# Altium project main.PrjPCB (part 1 of 2)
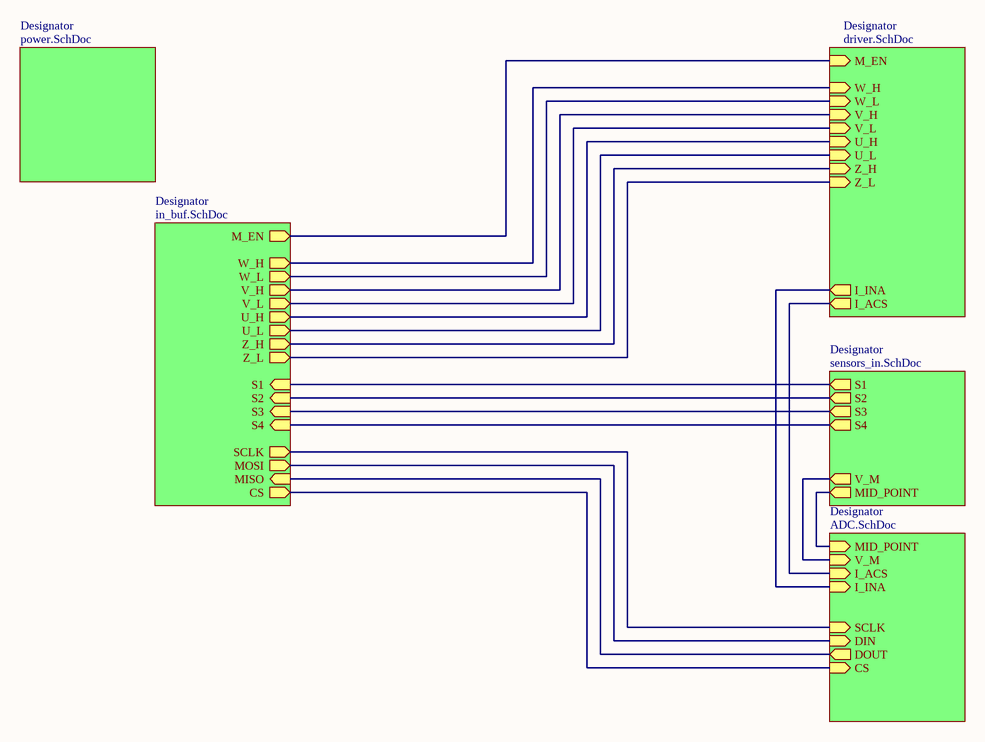
[diagram p0: top.SchDoc]
6 sheets, 154 parts. Net scope: hierarchical (ports join the sheet entries above them; power ports are global).
Board file: PCB1.PcbDoc
Sheets:
  top.SchDoc
    Designator = power.SchDoc
    Designator = driver.SchDoc
    Designator = ADC.SchDoc
    Designator = in_buf.SchDoc
    Designator = sensors_in.SchDoc

## Sheet top.SchDoc
size A4

### Sub-sheets
Designator = power.SchDoc: no entries
Designator = driver.SchDoc: Z_L (in), Z_H (in), U_L (in), V_L (in), U_H (in), I_INA (out), M_EN (in), W_H (in), W_L (in), V_H (in), I_ACS (out)
Designator = ADC.SchDoc: I_ACS (in), SCLK (in), MID_POINT (in), CS (in), I_INA (in), V_M (in), DIN (in), DOUT (out)
Designator = in_buf.SchDoc: U_L (out), MOSI (out), Z_H (out), S1 (in), M_EN (out), V_H (out), S4 (in), SCLK (out), Z_L (out), CS (out), MISO (in), W_L (out), S2 (in), S3 (in), V_L (out), U_H (out), W_H (out)
Designator = sensors_in.SchDoc: S1 (out), S4 (out), V_M (out), MID_POINT (out), S2 (out), S3 (out)

### Nets
CS: sheet Designator/CS, sheet Designator/CS
DIN: sheet Designator/DIN, sheet Designator/MOSI
DOUT: sheet Designator/DOUT, sheet Designator/MISO
I_ACS: sheet Designator/I_ACS, sheet Designator/I_ACS
I_INA: sheet Designator/I_INA, sheet Designator/I_INA
M_EN: sheet Designator/M_EN, sheet Designator/W_L, sheet Designator/M_EN, sheet Designator/W_L
MID_POINT: sheet Designator/MID_POINT, sheet Designator/MID_POINT
S1: sheet Designator/S1, sheet Designator/S1
S2: sheet Designator/S2, sheet Designator/S2
S3: sheet Designator/S3, sheet Designator/S3
S4: sheet Designator/S4, sheet Designator/S4
SCLK: sheet Designator/SCLK, sheet Designator/SCLK
U_H: sheet Designator/U_H, sheet Designator/U_H
U_L: sheet Designator/U_L, sheet Designator/U_L
V_H: sheet Designator/V_H, sheet Designator/V_H
V_L: sheet Designator/V_L, sheet Designator/V_L
V_M: sheet Designator/V_M, sheet Designator/V_M
W_H: sheet Designator/W_H, sheet Designator/W_H
Z_H: sheet Designator/Z_H, sheet Designator/Z_H
Z_L: sheet Designator/Z_L, sheet Designator/Z_L

## Sheet power.SchDoc
size A4
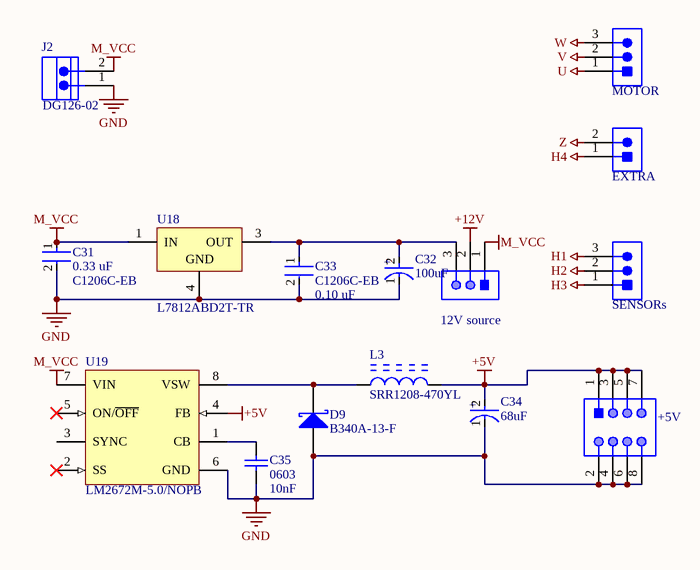
[diagram p1: power.SchDoc]

### Parts
12V_source  61300311121  [61300311121]  (value not drawn)
+5V  61300821121  [61300821121]  (value not drawn)
C31  Capacitance: 0.33 uF  Package: C1206C-EB  [FP-C1206C-EB-IPC_A]  (hidden comment: C1206C334M3VACTU)
C32  Capacitance: 100uF  [FP-PCR1J101MCL1GS-MFG]  (hidden comment: PCR1J101MCL1GS)
C33  Package: C1206C-EB  Capacitance: 0.10 uF  [FP-C1206C-EB-IPC_A]  (hidden comment: C1206C104KARACTU)
C34  Capacitance: 68uF  [FP-PCR1J101MCL1GS-MFG]  (hidden comment: PCR1J101MCL1GS)
C35  value 10nF  Case-EIA: 0603  [CAPC0603(1608)100_M]  (hidden comment: CAP 1nF 16V 0603(1608))
D9  B340A-13-F  [DIOD-SMA-2_V]
EXTRA  SCREW-5.0/5.08 2WAYS  [SCREW-5.0-2WAYS_V]  (value not drawn)
J2  DG126-02  [CXKF-KF129C-2_V]
L3  SRR1208-470YL  [BOUR-SRR1280-2_V]
MOTOR  SCREW-5.0/5.08 3WAYS  [SCREW-5.0-3WAYS_V]  (value not drawn)
SENSORs  SCREW-5.0/5.08 3WAYS  [SCREW-5.0-3WAYS_V]  (value not drawn)
U18  L7812ABD2T-TR  [TO-263_L]
U19  LM2672M-5.0/NOPB  [M08A_N]

### Nets
+5V: +5V.1 +5V.3 +5V.5 +5V.7 C34.2(A) L3.2 U19.4(FB)
+12V: 12V_source.2
GND: +5V.2 +5V.4 +5V.6 +5V.8 C31.2 C32.1(C) C33.2 C34.1(C) C35.1 D9.1(A) J2.1 U18.4(GND) U19.6(GND)
H1: SENSORs.3
H2: SENSORs.2
H3: SENSORs.1
H4: EXTRA.1
M_VCC: 12V_source.1 C31.1 J2.2 U18.1(IN) U19.7(VIN)
U: MOTOR.1
V: MOTOR.2
W: MOTOR.3
Z: EXTRA.2
Net12V_source_3: 12V_source.3 C32.2(A) C33.1 U18.3(OUT)
NetC35_2: C35.2 U19.1(CB)
NetD9_2: D9.2(K) L3.1 U19.8(VSW)

Not connected (* = marked no-connect by the designer): U19 2(SS)* 3(SYNC) 5(ON/~{OFF})*

### Notes on the sheet
- (in symbol CMP-12462-000005-1) +

### Library data of the parts
12V_source = CMP-1502-01062-1: THT Vertical Pin Header WR-PHD, Pitch 2.54 mm, Single Row, 3 pins; Manufacturer: Wurth Elektronik; Withstanding Voltage: 500VAC; Working Voltage: 250VAC; Rated Current: 3A; Pitch: 2.54mm; Pin Number: 3; Gender: Male; Contact Resistance: 20mOhm; Package Reference: 61300311121; Manufacturer URL: http://www.we-online.de; Datasheet URL: https://katalog.we-online.de/em/datasheet/6130xx11121.pdf; Operating Temperature: -40to105degC; Part Number: 61300311121; Orientation: Vertical; Packaging: Bag; Row Number: Single; Mounting Technology: THT; Publisher: WurthElektronik
+5V = CMP-1502-01078-1: THT Vertical Pin Header WR-PHD, Pitch 2.54 mm, Dual Row, 8 pins; Manufacturer: Wurth Elektronik; Contact Resistance: 20mOhm; Rated Current: 3A; Working Voltage: 250VAC; Pin Number: 8; Withstanding Voltage: 500VAC; Pitch: 2.54mm; Gender: Male; Datasheet URL: https://katalog.we-online.de/em/datasheet/6130xx21121.pdf; Package Reference: 61300821121; Orientation: Vertical; Part Number: 61300821121; Publisher: WurthElektronik; Mounting Technology: THT; Manufacturer URL: http://www.we-online.de; Packaging: Bag; Row Number: Dual; Operating Temperature: -40to105degC
C31 = CMP-03020-000898-1: CAP CER 0.33UF 25V Y5V 1206; Manufacturer: KEMET; Material: Ceramic; Value: 0.33 μF; Automotive Grade: Grade 0; Tolerance: 0.2; Temperature Coefficient: 15%; Ipc Land Pattern Name: CAPC320160X78; Height: 0.88mm; Automotive: Yes; Category: Cap; Manufacturer Part Number: C1206C334M3VACTU; Temperature Range High: +150°C; ComponentLink2URL: https://content.kemet.com/datasheets/KEM_C1007_X8R_ULTRA_150C_SMD.pdf; Device Class L3: Ceramic Capacitors; Device Class L2: Capacitors; Temperature: -55°C to +150°C; ComponentLink2Description: Datasheet; Mouser Description: Multilayer Ceramic Capacitors MLCC - SMD/SMT 25volts 0.33uF Y5V 20%; Octopart: https://octopart.com/c1206c334m3vactu-kemet-9139506; Temperature Characteristic: Y5V; Digikey Description: CAP CER 0.33UF 25V Y5V 1206; Voltage Rating: 25 V; Lead Free: Yes; RoHS: TRUE; Device Class L1: Passive Components; Temperature Range Low: -55°C
C32 C34 = CMP-12462-000005-1: CAP ALUM POLY 100UF 20% 63V SMD; Manufacturer: Nichicon; Ripple Current: 3000mA; Automotive Grade: Grade 1; Esr: 24mΩ; Dissipation Factor: 8%; Material: Aluminum; Life: 4000Hours; Leakage Current: 189uA; Voltage Rating: 63V; Device Class L1: Passive Components; Package: 0; Automotive: Yes; Manufacturer Part Number: PCR1J101MCL1GS; Device Class L3: Aluminum Electrolytic Capacitors; ComponentLink2URL: https://www.nichicon.co.jp/english/products/pdfs/e-pcr.pdf; Category: Cap; ComponentLink2Description: Datasheet; Lead Free: Yes; Tolerance: 20%; Digikey Description: CAP ALUM POLY 100UF 20% 63V SMD; Temperature: -55°C to +125°C; Temperature Range High: +125°C; Value: 100uF; Temperature Range Low: -55°C; Height: 12.7mm; Octopart: https://octopart.com/pcr1j101mcl1gs-nichicon-34508535; Device Class L2: Capacitors; Footprint Url: https://www.nichicon.co.jp/english/products/pdfs/e-p_ref.pdf; RoHS: TRUE
C33 = CMP-03020-000666-1: CAP CER 0.1UF 250V X7R 1206; Manufacturer: KEMET; Material: Ceramic; Temperature Coefficient: 15%; Value: 0.10 μF; Tolerance: 0.1; Automotive Grade: Grade 0; Mouser Description: Multilayer Ceramic Capacitors MLCC - SMD/SMT 250volts 0.1uF X7R 10%; Height: 0.88mm; Device Class L3: Ceramic Capacitors; Temperature Range Low: -55°C; Automotive: Yes; ComponentLink2Description: Datasheet; Category: Cap; RoHS: TRUE; Manufacturer Part Number: C1206C104KARACTU; Temperature Range High: +150°C; Device Class L2: Capacitors; Voltage Rating: 250 V; Lead Free: Yes; Temperature Characteristic: X7R; Digikey Description: CAP CER 0.1UF 250V X7R 1206; ComponentLink2URL: https://content.kemet.com/datasheets/KEM_C1007_X8R_ULTRA_150C_SMD.pdf; Device Class L1: Passive Components; Ipc Land Pattern Name: CAPC320160X78; Temperature: -55°C to +150°C; Octopart: https://octopart.com/c1206c104karactu-kemet-193627
C35 = CMP-1035-01877-1: CAP 1nF 16V ±2% 0603 (1608 Metric) Thickness 1mm SMD; Case-Metric: 1608; Tolerance: Â±2%; Max Thickness: 1 mm; Rated Voltage: 16 V; Technology: SMT
D9 = CMP-1667-00003-1: Surface Mount Schottky Barrier Rectifier, 40 V, 3 A, -55 to 150 degC, 2-Pin SMA, RoHS, Tape and Reel; Forward Current: 3 A; Forward Voltage: 500 mV; Max Surge Current: 80 A; Peak Reverse Current: 500 uA; Elements: 1; Mounting Technology: Surface Mount; ComponentLink1URL: http://www.diodes.com/; PackageDescription: 2-Pin Surface Mounted Assembly, Body 4.3 x 2.605 mm, Height 2.4 mm; Min Operating Temperature: -55 degC; Mount: Surface Mount; Pins: 2; ComponentLink2URL: http://www.diodes.com/_files/datasheets/ds30891.pdf; PackageReference: SMA-2; Max Operating Temperature: 125 degC; Radiation Hardening: No; Length: 4.6 mm; RoHSCompliant: true; ComponentLink1Description: Manufacturer URL; Height: 2.1 mm; ComponentLink2Description: Datasheet; Packaging: Tape and Reel; Package Quantity: 5000; Case\Package: SMA; DatasheetVersion: Rev. 17 - 2, 09/2015; REACH SVHC: No SVHC; Width: 2.92 mm
EXTRA = CMP-0617-00009-1: Socket, Screw Terminal Block, 2 Way, 5.0 mm Pitch, 90 Degree Angle, Through-Hole; Manufacturer: No Vendor; Insulation Resistance: 5000 MOhm / 1000 V; Contact Resistance: 20 mOhm; Rated Current: 25 A; Poles: 2; Rated Voltage: 300 V; PartNumber: SCREW-5.0/5.08 2WAYS; ComponentLink1Description: Datasheet; ComponentLink1URL: 5mm screw terminal in SVN; Mounting Technology: Through Hole; PackageDescription: Socket, Screw Terminal Block, 2 Way, Pitch 5 mm, 90 Degree Angle, Through-Hole; Temperature Range: -40 to 105 degC
J2 = CMP-0813-00004-1: Euro Terminal Block, 20 A, 300 V, -40 to 105 degC, Pitch 5 mm, 1 x 2 Position, Height 19.2 mm, Tail Length 3.5 mm; PartNumber: KF129C-02P-14; Manufacturer: Cixi KaiFeng; Insulation Resistance: 5000 MOhm / 1000 V; Pitch: Single Pitch; No. of Pole: 2; Rated Voltage: 300 V; Contact: Brass; Rated Current: 20 A; Contact Resistance: 20 mOhm; Withstanding Voltage: AC 1500 V / 1 Min; ComponentLink2Description: Datasheet; PackageReference: KF129C-2; ComponentLink1URL: http://www.nb-kaifeng.com/; ComponentLink2URL: http://www.nb-kaifeng.com/upload/editor/ext_pdf/201208170644598657.pdf; Color: Green; PackageDescription: Terminal Block, Pitch 5 mm, 1 x 2 Position, Height 19.2 mm, Tail Length 3.5 mm; Temp. Range: -40 to 105 degC; Mounting Technology: Through Hole; ComponentLink1Description: Manufacturer URL
L3 = CMP-2000-07147-1: Semi-Shielded Power Inductor, 100 uH, +/- 20%, 2.1 A, -40 to 125 degC, 2-Pin SMD, RoHS, Tape and Reel; Manufacturer: Bourns; Frequency - Self Resonant: 4.5MHz; Frequency - Test: 100kHz; Material - Core: Ferrite; EDA / CAD Models: DownloadfromAcceleratedDesigns; Other Names: SRR1280-101MTR / SRR1280101M; Q @ Freq: 18@796kHz; Product Training Modules: MagneticProductOverview; Current Rating: 2.1A; Inductance: 100µH; PCN Design/Specification: SRR12(6,8,1)0,PM12(5,7)SHModels17/Aug/2011; Online Catalog: SRRSeries; Type: Wirewound; PCN Assembly/Origin: MagneticproductsOct/2013; 3D Model: SRR1208.stp; Current - Saturation: 2A; DC Resistance (DCR): 150mOhmMax; Mounting Type: SurfaceMount; RoHS Information: SRR1280SeriesMaterialDeclaration; Manufacturer URL: http://www.bourns.com/; Packaging: Tape&Reel(TR); Package URL: http://www.bourns.com/docs/Product-Datasheets/SRR1280.pdf; Package / Case: Nonstandard; Datasheet URL: http://www.bourns.com/pdfs/SRR1280.pdf; Mounting Technology: SurfaceMount; Operating Temperature: -40°C~125°C; Shielding: Shielded; Category: Inductors,Coils,Chokes; Tolerance: ±20%; Package Reference: SRR1280-2; Datasheet Version: 03/2015; Family: FixedInductors; Package Description: 2-Pin Surface Mount Device, Body 12.5 x 12.5 mm; Series: SRR1280; Standard Package: 400
MOTOR SENSORs = CMP-0617-00010-1: Socket, Screw Terminal Block, 3 Way, 5.0 mm Pitch, 90 Degree Angle, Through-Hole; Manufacturer: No Vendor; Insulation Resistance: 5000 MOhm / 1000 V; Rated Voltage: 300 V; Poles: 3; Contact Resistance: 20 mOhm; Rated Current: 25 A; PartNumber: SCREW-5.0/5.08 3WAYS; PackageDescription: Socket, Screw Terminal Block, 3 Way, Pitch 5 mm, 90 Degree Angle, Through-Hole; Temperature Range: -40 to 105 degC; ComponentLink1Description: Datasheet; ComponentLink1URL: 5mm screw terminal in SVN; Mounting Technology: Through Hole
U18 = CMP-0244-00181-1: Positive Voltage Regulator, 3-Pin D2PAK, Tape and Reel; ComponentLink1Description: Manufacturer URL; ComponentLink2URL: http://www.st.com/internet/com/TECHNICAL_RESOURCES/TECHNICAL_LITERATURE/DATASHEET/CD00000444.pdf; PackageVersion: 2011; PackageDescription: 3-Pin Transistor Outline Package 2.54 mm Pitch, 15.4 mm Lead Span (D2PAK); DatasheetVersion: 16/11/2011; PackageReference: TO-263; ComponentLink1URL: http://www.st.com; ComponentLink2Description: Datasheet
U19 = CMP-0069-00668-1: SIMPLE SWITCHER® Power Converter High Efficiency 1A Step-Down Voltage Regulator with Features, 8-pin Narrow SOIC, Pb-Free; Manufacturer: National Semiconductor; PowerWise: N; PackageTopMarking: NSZXTT*2672*M5.0; PackageReference: M08A; CompType: Switcher; Code_IPC: SOIC127P600-8; PackageDescription: SOIC Narrow, 4.9 x 3.9 x 1.45mm, 8 Lead, 1.27mm Pitch; Code_JEDEC: MS-012-AA; RoHS: Y; PackageVersion: revM, May-2009; DatasheetVersion: Apr-2007; PinCount: 8

## Sheet driver.SchDoc
size A3
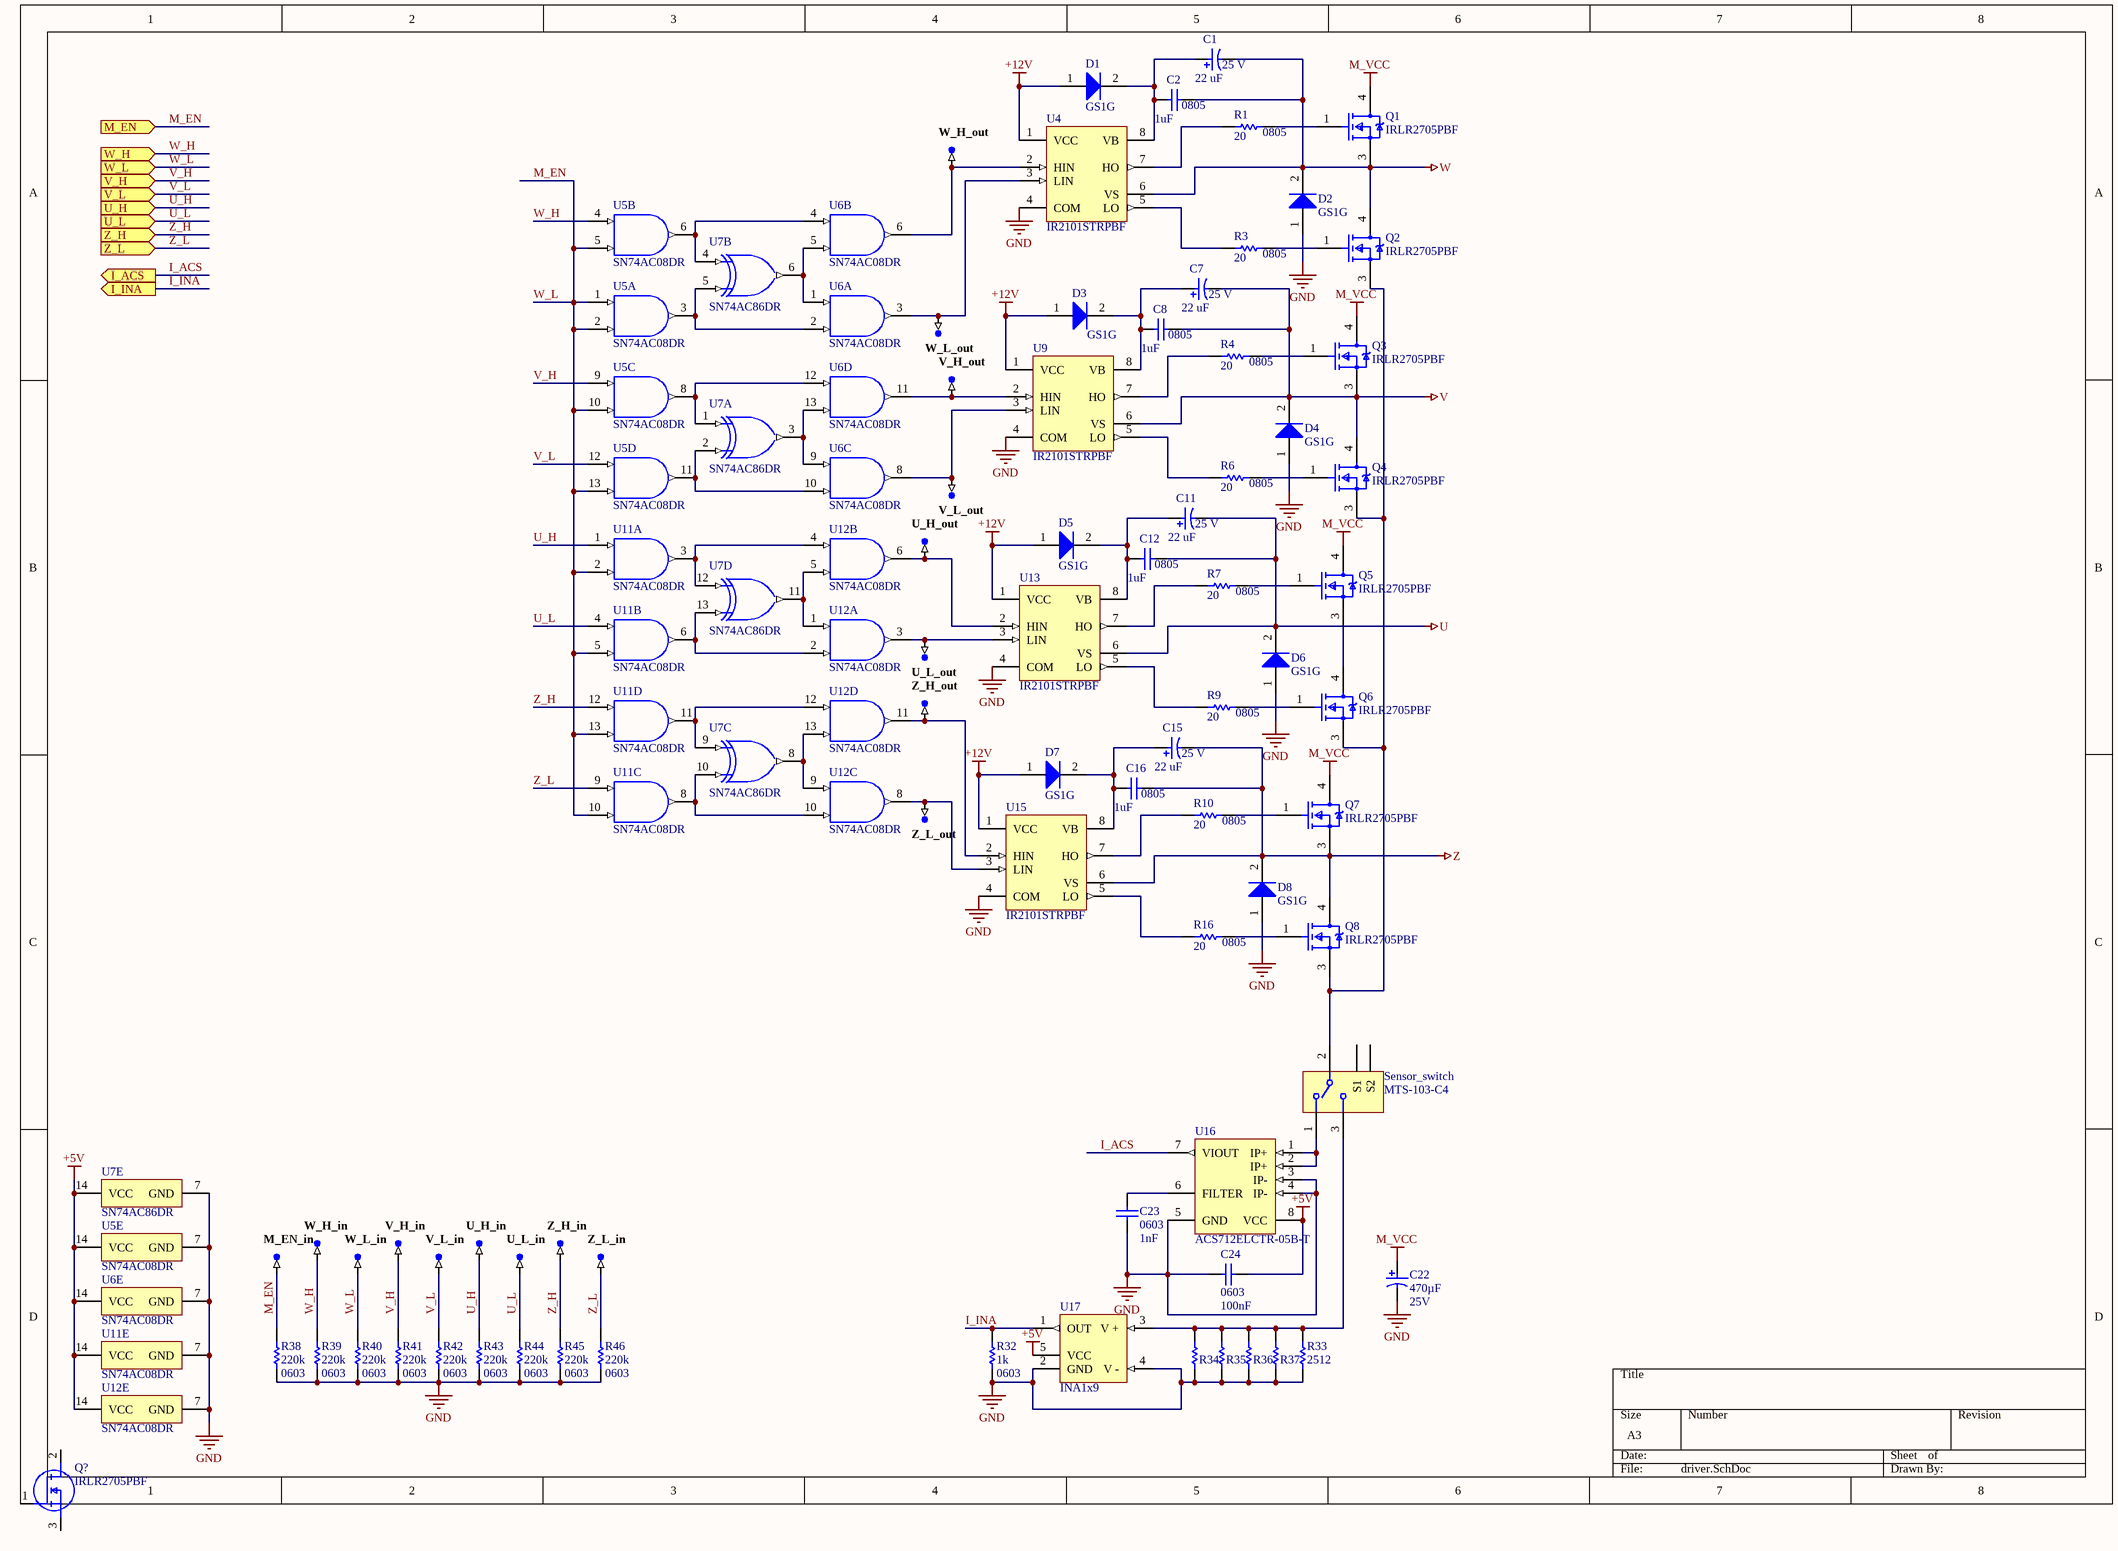
[diagram p2: driver.SchDoc]

### Parts
C1  Rated Voltage: 25 V  Capacitance: 22 uF  [PNSC-FT-V-43x43-2_V]  (hidden comment: EEE-FT1E220AR)
C2  value 1uF  Case-EIA: 0805  [CAPC0805(2012)145_M]  (hidden comment: CAP 1uF 50V 0805(2012))
C7  Rated Voltage: 25 V  Capacitance: 22 uF  [PNSC-FT-V-43x43-2_V]  (hidden comment: EEE-FT1E220AR)
C8  value 1uF  Case-EIA: 0805  [CAPC0805(2012)145_M]  (hidden comment: CAP 1uF 50V 0805(2012))
C11  Rated Voltage: 25 V  Capacitance: 22 uF  [PNSC-FT-V-43x43-2_V]  (hidden comment: EEE-FT1E220AR)
C12  value 1uF  Case-EIA: 0805  [CAPC0805(2012)145_M]  (hidden comment: CAP 1uF 50V 0805(2012))
C15  Rated Voltage: 25 V  Capacitance: 22 uF  [PNSC-FT-V-43x43-2_V]  (hidden comment: EEE-FT1E220AR)
C16  value 1uF  Case-EIA: 0805  [CAPC0805(2012)145_M]  (hidden comment: CAP 1uF 50V 0805(2012))
C22  Capacitance: 470µF  Rated Voltage: 25V  [PNSC-FP-V-G_V]  (hidden comment: EEEFP1E471AP)
C23  value 1nF  Case-EIA: 0603  [CAPC0603(1608)100_M]  (hidden comment: CAP 1nF 16V 0603(1608))
C24  Case Code (Imperial): 0603  Capacitance: 100nF  [CAPC1608X90X35ML10T15]  (hidden comment: GRM188R71H104KA93D)
D1  GS1G  [VISH-DO-214AC_V]
D2  GS1G  [VISH-DO-214AC_V]
D3  GS1G  [VISH-DO-214AC_V]
D4  GS1G  [VISH-DO-214AC_V]
D5  GS1G  [VISH-DO-214AC_V]
D6  GS1G  [VISH-DO-214AC_V]
D7  GS1G  [VISH-DO-214AC_V]
D8  GS1G  [VISH-DO-214AC_V]
M_EN_in  TP-SM-C-100  [TP-SM-C-100]  (value not drawn)  (no BOM)
Q1  IRLR2705PBF  [FP-PG-TO252-3-MFG]
Q2  IRLR2705PBF  [FP-PG-TO252-3-MFG]
Q3  IRLR2705PBF  [FP-PG-TO252-3-MFG]
Q4  IRLR2705PBF  [FP-PG-TO252-3-MFG]
Q5  IRLR2705PBF  [FP-PG-TO252-3-MFG]
Q6  IRLR2705PBF  [FP-PG-TO252-3-MFG]
Q7  IRLR2705PBF  [FP-PG-TO252-3-MFG]
Q8  IRLR2705PBF  [FP-PG-TO252-3-MFG]
Q?  IRLR2705PBF  [IRLR2705PBF]
R1  value 20  Case-EIA: 0805  [RESC0805(2012)_M]  (hidden comment: 20R 1% 0805(2012))
R3  value 20  Case-EIA: 0805  [RESC0805(2012)_M]  (hidden comment: 20R 1% 0805(2012))
R4  value 20  Case-EIA: 0805  [RESC0805(2012)_M]  (hidden comment: 20R 1% 0805(2012))
R6  value 20  Case-EIA: 0805  [RESC0805(2012)_M]  (hidden comment: 20R 1% 0805(2012))
R7  value 20  Case-EIA: 0805  [RESC0805(2012)_M]  (hidden comment: 20R 1% 0805(2012))
R9  value 20  Case-EIA: 0805  [RESC0805(2012)_M]  (hidden comment: 20R 1% 0805(2012))
R10  value 20  Case-EIA: 0805  [RESC0805(2012)_M]  (hidden comment: 20R 1% 0805(2012))
R16  value 20  Case-EIA: 0805  [RESC0805(2012)_M]  (hidden comment: 20R 1% 0805(2012))
R32  Resistance (Ohms): 1k  Package Reference: 0603  [RESC1608X55X30ML15T20]  (hidden comment: RMCF0603FT10K0)
R33  Case-EIA: 2512  [RESC2512(6432)_N]  (hidden comment: 1R 5% 2512(6432))
R34  1R 5% 2512(6432)  [RESC2512(6432)_N]  (value not drawn)
R35  1R 5% 2512(6432)  [RESC2512(6432)_N]  (value not drawn)
R36  1R 5% 2512(6432)  [RESC2512(6432)_N]  (value not drawn)
R37  1R 5% 2512(6432)  [RESC2512(6432)_N]  (value not drawn)
R38  Resistance (Ohms): 220k  Package Reference: 0603  [RESC1608X55X30ML15T20]  (hidden comment: RMCF0603FT10K0)
R39  Resistance (Ohms): 220k  Package Reference: 0603  [RESC1608X55X30ML15T20]  (hidden comment: RMCF0603FT10K0)
R40  Resistance (Ohms): 220k  Package Reference: 0603  [RESC1608X55X30ML15T20]  (hidden comment: RMCF0603FT10K0)
R41  Resistance (Ohms): 220k  Package Reference: 0603  [RESC1608X55X30ML15T20]  (hidden comment: RMCF0603FT10K0)
R42  Resistance (Ohms): 220k  Package Reference: 0603  [RESC1608X55X30ML15T20]  (hidden comment: RMCF0603FT10K0)
R43  Resistance (Ohms): 220k  Package Reference: 0603  [RESC1608X55X30ML15T20]  (hidden comment: RMCF0603FT10K0)
R44  Resistance (Ohms): 220k  Package Reference: 0603  [RESC1608X55X30ML15T20]  (hidden comment: RMCF0603FT10K0)
R45  Resistance (Ohms): 220k  Package Reference: 0603  [RESC1608X55X30ML15T20]  (hidden comment: RMCF0603FT10K0)
R46  Resistance (Ohms): 220k  Package Reference: 0603  [RESC1608X55X30ML15T20]  (hidden comment: RMCF0603FT10K0)
Sensor_switch  MTS-103-C4  [SALE-T8019L-5_V]
U4  IR2101STRPBF  [INTR-SOIC-8_V]
U5  SN74AC08DR  [D0014A_M]  (parts A,B,C,D,E of 5)
U6  SN74AC08DR  [D0014A_M]  (parts A,B,C,D,E of 5)
U7  SN74AC86DR  [D0014A_M]  (parts A,B,C,D,E of 5)
U9  IR2101STRPBF  [INTR-SOIC-8_V]
U11  SN74AC08DR  [D0014A_M]  (parts A,B,C,D,E of 5)
U12  SN74AC08DR  [D0014A_M]  (parts A,B,C,D,E of 5)
U13  IR2101STRPBF  [INTR-SOIC-8_V]
U15  IR2101STRPBF  [INTR-SOIC-8_V]
U16  ACS712ELCTR-05B-T  [ALEG-LC-8_V]
U17  INA1x9  [DIOD-SOT23-5_V]
U_H_in  TP-SM-C-100  [TP-SM-C-100]  (value not drawn)  (no BOM)
U_H_out  TP-SM-C-100  [TP-SM-C-100]  (value not drawn)  (no BOM)
U_L_in  TP-SM-C-100  [TP-SM-C-100]  (value not drawn)  (no BOM)
U_L_out  TP-SM-C-100  [TP-SM-C-100]  (value not drawn)  (no BOM)
V_H_in  TP-SM-C-100  [TP-SM-C-100]  (value not drawn)  (no BOM)
V_H_out  TP-SM-C-100  [TP-SM-C-100]  (value not drawn)  (no BOM)
V_L_in  TP-SM-C-100  [TP-SM-C-100]  (value not drawn)  (no BOM)
V_L_out  TP-SM-C-100  [TP-SM-C-100]  (value not drawn)  (no BOM)
W_H_in  TP-SM-C-100  [TP-SM-C-100]  (value not drawn)  (no BOM)
W_H_out  TP-SM-C-100  [TP-SM-C-100]  (value not drawn)  (no BOM)
W_L_in  TP-SM-C-100  [TP-SM-C-100]  (value not drawn)  (no BOM)
W_L_out  TP-SM-C-100  [TP-SM-C-100]  (value not drawn)  (no BOM)
Z_H_in  TP-SM-C-100  [TP-SM-C-100]  (value not drawn)  (no BOM)
Z_H_out  TP-SM-C-100  [TP-SM-C-100]  (value not drawn)  (no BOM)
Z_L_in  TP-SM-C-100  [TP-SM-C-100]  (value not drawn)  (no BOM)
Z_L_out  TP-SM-C-100  [TP-SM-C-100]  (value not drawn)  (no BOM)

### Ports
I_ACS (out), I_INA (out), M_EN (in), U_H (in), U_L (in), V_H (in), V_L (in), W_H (in), W_L (in), Z_H (in), Z_L (in)

### Nets
+5V: C24.2 U5.14(VCC) U6.14(VCC) U7.14(VCC) U11.14(VCC) U12.14(VCC) U16.8(VCC) U17.5(VCC)
+12V: D1.1(+) D3.1(+) D5.1(+) D7.1(+) U4.1(VCC) U9.1(VCC) U13.1(VCC) U15.1(VCC)
GND: C22.2 C23.1 C24.1 D2.1(+) D4.1(+) D6.1(+) D8.1(+) R32.1 R33.2 R34.2 R35.2 R36.2 R37.2 R38.1 R39.1 R40.1 R41.1 R42.1 R43.1 R44.1 R45.1 R46.1 U4.4(COM) U5.7(GND) U6.7(GND) U7.7(GND) U9.4(COM) U11.7(GND) U12.7(GND) U13.4(COM) U15.4(COM) U16.3(IP-) U16.4(IP-) U16.5(GND) U17.2(GND) U17.4(V_-)
M_VCC: C22.1 Q1.4(D) Q3.4(D) Q5.4(D) Q7.4(D)
U: C11.2 C12.1 D6.2(-) Q5.3(S) Q6.4(D) U13.6(VS)
V: C7.2 C8.1 D4.2(-) Q3.3(S) Q4.4(D) U9.6(VS)
W: C1.2 C2.1 D2.2(-) Q1.3(S) Q2.4(D) U4.6(VS)
Z: C15.2 C16.1 D8.2(-) Q7.3(S) Q8.4(D) U15.6(VS)
I_ACS: U16.7(VIOUT) ; port I_ACS
I_INA: R32.2 U17.1(OUT) ; port I_INA
M_EN: M_EN_in.1 R38.2 R40.2 U5.1(1A) U5.2(1B) U5.5(2B) U5.10(3B) U5.13(4B) U11.2(1B) U11.5(2B) U11.10(3B) U11.13(4B) W_L_in.1 ; port W_L, port M_EN  [also labelled W_L]
U_H: R43.2 U11.1(1A) U_H_in.1 ; port U_H
U_L: R44.2 U11.4(2A) U_L_in.1 ; port U_L
V_H: R41.2 U5.9(3A) V_H_in.1 ; port V_H
V_L: R42.2 U5.12(4A) V_L_in.1 ; port V_L
W_H: R39.2 U5.4(2A) W_H_in.1 ; port W_H
Z_H: R45.2 U11.12(4A) Z_H_in.1 ; port Z_H
Z_L: R46.2 U11.9(3A) Z_L_in.1 ; port Z_L
NetC1_1: C1.1 C2.2 D1.2(-) U4.8(VB)
NetC7_1: C7.1 C8.2 D3.2(-) U9.8(VB)
NetC11_1: C11.1 C12.2 D5.2(-) U13.8(VB)
NetC15_1: C15.1 C16.2 D7.2(-) U15.8(VB)
NetC23_2: C23.2 U16.6(FILTER)
NetQ1_1: Q1.1(G) R1.1
NetQ2_1: Q2.1(G) R3.1
NetQ2_3: Q2.3(S) Q4.3(S) Q6.3(S) Q8.3(S) Sensor_switch.2
NetQ3_1: Q3.1(G) R4.1
NetQ4_1: Q4.1(G) R6.1
NetQ5_1: Q5.1(G) R7.1
NetQ6_1: Q6.1(G) R9.1
NetQ7_1: Q7.1(G) R10.1
NetQ8_1: Q8.1(G) R16.1
NetR1_2: R1.2 U4.7(HO)
NetR3_2: R3.2 U4.5(LO)
NetR4_2: R4.2 U9.7(HO)
NetR6_2: R6.2 U9.5(LO)
NetR7_2: R7.2 U13.7(HO)
NetR9_2: R9.2 U13.5(LO)
NetR10_2: R10.2 U15.7(HO)
NetR16_2: R16.2 U15.5(LO)
NetR33_1: R33.1 R34.1 R35.1 R36.1 R37.1 Sensor_switch.3 U17.3(V_+)
NetSensor_switch_1: Sensor_switch.1 U16.1(IP+) U16.2(IP+)
NetU4_2: U4.2(HIN) U6.6(2Y) W_H_out.1
NetU4_3: U4.3(LIN) U6.3(1Y) W_L_out.1
NetU5_3: U5.3(1Y) U6.2(1B) U7.5(2B)
NetU5_6: U5.6(2Y) U6.4(2A) U7.4(2A)
NetU5_8: U5.8(3Y) U6.12(4A) U7.1(1A)
NetU5_11: U5.11(4Y) U6.10(3B) U7.2(1B)
NetU6_1: U6.1(1A) U6.5(2B) U7.6(2Y)
NetU6_8: U6.8(3Y) U9.3(LIN) V_L_out.1
NetU6_9: U6.9(3A) U6.13(4B) U7.3(1Y)
NetU6_11: U6.11(4Y) U9.2(HIN) V_H_out.1
NetU7_8: U7.8(3Y) U12.9(3A) U12.13(4B)
NetU7_9: U7.9(3A) U11.11(4Y) U12.12(4A)
NetU7_10: U7.10(3B) U11.8(3Y) U12.10(3B)
NetU7_11: U7.11(4Y) U12.1(1A) U12.5(2B)
NetU7_12: U7.12(4A) U11.3(1Y) U12.4(2A)
NetU7_13: U7.13(4B) U11.6(2Y) U12.2(1B)
NetU12_3: U12.3(1Y) U13.3(LIN) U_L_out.1
NetU12_6: U12.6(2Y) U13.2(HIN) U_H_out.1
NetU12_8: U12.8(3Y) U15.3(LIN) Z_L_out.1
NetU12_11: U12.11(4Y) U15.2(HIN) Z_H_out.1

Not connected (* = marked no-connect by the designer): Q? 1(G) 2(D) 3(S); Sensor_switch S1 S2

### Library data of the parts
C1 C7 C11 C15 = CMP-0744-00004-1: Aluminum Electrolytic Capacitor, 22 uF +/- 20%, 25 V, -55 to 105 degC, 2-Pin 4.3 x 4.3 x 6.1 mm SMD, RoHS, Tape and Reel; Manufacturer: Panasonic; Ripple Current: 160 mA; Capacitance Tolerance: +/- 20%; Packing: Tape and Reel; PackageReference: FT-V-43x43-2; DatasheetVersion: Mar-14; ComponentLink3Description: Package Specification; PackageDescription: 2-Pin SMD, Body 4.3 x 4.3 mm, Height 6.1 mm; ComponentLink1Description: Manufacturer URL; ComponentLink2Description: Datasheet; PartNumber: EEE-FT1E220AR; ComponentLink3URL: http://industrial.panasonic.com/www-data/pdf/ABA0000/ABA0000PE248.pdf; RoHS: TRUE; PackageVersion: Feb-14; Temp. Range: -55 to 105 degC; ComponentLink2URL: http://industrial.panasonic.com/www-data/pdf/ABA0000/ABA0000CE135.pdf; ComponentLink1URL: http://www.panasonic.com/industrial/electronic-components/; Mounting Technology: Surface Mount
C2 C8 C12 C16 = CMP-1036-04761-1: CAP 1uF 50V ±10% 0805 (2012 Metric) Thickness 1.45mm SMD; Tolerance: Â±10%; Case-Metric: 2012; Technology: SMT; Max Thickness: 1.45 mm; Rated Voltage: 50 V
C22 = CMP-2000-06214-1: Aluminum Electrolytic Capacitor, 470 uF, +/- 20%, 25 V, 2-Pin SMD (Size Code G), -55 to 105 degC, RoHS, Tape and Reel; Manufacturer: Panasonic; Ripple Current: 1190mA; ESR (Equivalent Series Resistance): 0.06O; Type: Can; Lifetime@Temperature: 2000Hrs@105°C; Package Reference: FP-V-G; Case Size/Dimension: Ø10x10.2mm; Mounting Technology: SurfaceMount; Datasheet Version: 03/2016; Datasheet URL: http://industrial.panasonic.com/cdbs/www-data/pdf/RDE0000/ABA0000C1184.pdf; Series: FP; Operating Temp Range: -55to+105°C; Operating Temp-Max: 105°C; Package URL: http://industrial.panasonic.com/cdbs/www-data/pdf/RDE0000/DME0000COL48.pdf; Package Description: 2-Pin Electrolytic Aluminum Capacitor, Body 10.3 x 10.3 mm; Manufacturer URL: http://www.panasonic.com/
C23 = CMP-1035-01877-1: as C35 on sheet power; Max Thickness: 1 mm; Rated Voltage: 16 V; Technology: SMT
C24 = CMP-2100-03643-1: Chip Capacitor, 0.1 uF, +/- 10%, 50 V, -55 to 125 degC, 0603 (1608 Metric), RoHS, Tape and Reel; Manufacturer: Murata; Dielectric Material: Ceramic; Voltage Rating: 50V; Dielectric: X7R; Insulation Resistance: 10GR; Case Code (Metric): 1608; Lead Free: LeadFree; Depth: 0.8mm; Number of Pins: 2; Radiation Hardening: No; Case/Package: 0603; Manufacturer URL: http://www.murata.com/; Packaging: TapeandReel; Length: 1.6mm; Contact Plating: Tin; Datasheet URL: http://psearch.en.murata.com/capacitor/product/GRM188R71H104KA93%23.pdf; Tolerance: 10%; Min Operating Temperature: -55degC; RoHSCompliant: true; Voltage: 50V; Termination: SMD/SMT; Mount: SurfaceMount; Material: Ceramic; Package Quantity: 1; Height: 0.8mm; Thickness: 0.035inch; REACH SVHC: NoSVHC; Max Operating Temperature: 125degC; Width: 0.8mm; Package Reference: 0603; Voltage Rating (DC): 50V; Datasheet Version: 42675.0; Package Description: 2-Pin Surface Mount Device, Body 1.6 x 0.8 mm
D1-D8 = CMP-1666-00011-1: DIODE GPP 1A 400V SMA; PartNumber: S1G-E3/61T; ComponentLink1Description: Datasheet; ComponentLink1URL: http://www.vishay.com/docs/88711/s1.pdf; PackageReference: DO-214AC
M_EN_in U_H_in U_H_out U_L_in U_L_out V_H_in V_H_out V_L_in V_L_out W_H_in W_H_out W_L_in W_L_out Z_H_in Z_H_out Z_L_in Z_L_out = CMP-0484-00002-2: Test Point, Surface Mount, Circular, Pad Diameter 1 mm; Manufacturer: No Vendor; PartNumber: TP-SM-C-100
Q1-Q8 = CMP-32901-000108-1: MOSFET N-CH 55V 44A DPAK; Manufacturer: Infineon; Manufacturer Part Number: IRFR1205TRPBF; Input Capacitace At Vds: 1300pF @ 25V; Depletion Mode: False; Pulse Drain Current: 160A; Gate Charge At Vgs: 65nC @ 10V; Gate To Source Voltage: 20V; Turn On Delay Time: 7.3ns; Number Of Channels: 1; Transconductance: 17S; Reverse Recovery Time: 65ns; Threshold Vgs Max: 4V; Turn Off Delay Time: 47ns; Threshold Vgs Min: 2V; Reverse Recovery Charge: 160nC; Rthja Max: 50°C/W; Drain To Source Resistance: 0.027Ω; Max Junction Temp: +175°C; Max Forward Diode Voltage: 1.3V; Power Dissipation: 107W; RoHS: TRUE; Category: Trans; Height: 2.52mm; Drain To Source Voltage: 55V; Device Class L1: Discrete Semiconductors; Octopart: https://octopart.com/irfr1205trpbf-infineon-65874068; Drain To Source Breakdown Voltage: 55V; Number Of N Channels: 1; ComponentLink2URL: https://www.infineon.com/dgdl/irfr1205pbf.pdf?fileId=5546d462533600a40153562d17792047; Temperature Range Low: -55°C; Temperature: -55°C to +175°C; Digikey Description: MOSFET N-CH 55V 44A DPAK; Device Class L2: Transistors; Temperature Range High: +175°C; Package: PG-TO252-3; Automotive: No; Continuous Drain Current: 44A; Device Class L3: MOSFETs; ComponentLink2Description: Datasheet; Footprint Url: https://www.infineon.com/cms/en/product/packages/PG-TO252/PG-TO252-3-901/; Lead Free: Yes
Q? = IRLR2705PBF: MOSFET (N-Channel); Manufacturer_Name: Infineon; Datasheet Link: https://www.infineon.com/dgdl/irlr2705pbf.pdf?fileId=5546d462533600a40153566cb38f2673; Height: 2.52mm; Manufacturer_Part_Number: IRLR2705PBF; Mouser Part Number: 942-IRLR2705PBF; Mouser Price/Stock: https://www.mouser.co.uk/ProductDetail/Infineon-Technologies/IRLR2705PBF?qs=nrWyqPbesnUy1Tll%252BwV04A%3D%3D; Arrow Part Number: IRLR2705PBF; Arrow Price/Stock: https://www.arrow.com/en/products/irlr2705pbf/infineon-technologies-ag
R1 R3 R4 R6 R7 R9 R10 R16 = CMP-1013-00316-1: 20R 0.125W 1% 0805 (2012 Metric)  SMD; Case-Metric: 2012; Tolerance: 1 %; Technology: SMT; Power: 0.125 W
R32 R38-R46 = CMP-2000-06990-1: Chip Resistor, 10 KOhm, +/- 1%, 0.1 W, -55 to 155 degC, 0603 (1608 Metric), RoHS, Tape and Reel; Manufacturer: Stackpole-Electronics-Inc.; Temperature Coefficient: ±100ppm/°C; Power (Watts): 0.1W,1/10W; Package / Case: 0603(1608Metric); Datasheet Version: 01/2017; Features: AutomotiveAEC-Q200; Packaging: CutTape(CT); Series: RMCF; Tolerance: ±1%; Manufacturer URL: https://www.seielect.com/; Datasheet URL: https://www.seielect.com/Catalog/SEI-RMCF_RMCP.pdf; Supplier Device Package: 0603; Number of Terminations: 2; Family: ChipResistor-SurfaceMount; Mounting Technology: SurfaceMount; Package Description: 2-Pin Surface Mount Device, Body 1.55 x 0.8 mm; Operating Temperature: -55°C~155°C; Composition: ThickFilm; Category: Resistors
R33 = CMP-1018-00002-1: 1R 1W 5% 2512 (6432 Metric)  SMD; Case-Metric: 6432; Value: 1.00 Ohm; Technology: SMT; Power: 1 W; Tolerance: 5 %
R34-R37 = CMP-1018-00002-1: 1R 1W 5% 2512 (6432 Metric)  SMD; Case-Metric: 6432; Value: 1.00 Ohm; Case-EIA: 2512; Technology: SMT; Power: 1 W; Tolerance: 5 %
Sensor_switch = CMP-0428-00001-1: Toggle Switch, SPDT, Through Hole, 3 Terminals; Manufacturer: Salecom Electronics; PartNumber: T8019L-TNQ; Mechanical Life: 50,000 cycles; ComponentLink2Description: Datasheet; PackageReference: T8019L; ComponentLink1Description: Manufacturer URL; PackageDescription: Toggle Switch, 3 Leads, Vertical Right Angle; ComponentLink1URL: http://www.salecom.com/; DatasheetVersion: Jul-12; ComponentLink2URL: http://www.salecom.com/pdf/toggle%20switch_T80-T.pdf; Operating Temperature: -30 to +85 degC; Mounting Technology: Through Hole
U4 U9 U13 U15 = CMP-1671-00001-2: IC DRIVER HIGH/LOW SIDE 8SOIC; PartNumber: IR2181STRPBF; Manufacturer: International Rectifier; ComponentLink1Description: Datasheet; ComponentLink1URL: http://www.infineon.com/dgdl/ir2181.pdf?fileId=5546d462533600a4015355c93cdd16ce; PackageReference: SOIC-8
U5 U6 U11 U12 = CMP-0777-00059-2: Quadruple 2-Input Positive-AND Gates, D0014A, LARGE T&R; Manufacturer: Texas Instruments; F @ Nom Voltage(Max)(Mhz): 100; Output Drive (IOL/IOH)(Max)(mA): -24/24; Input Type: CMOS; Technology Family: AC; Voltage(Nom)(V): 3.3,5; Bits(#): 4; VCC(Min)(V): 2; ICC @ Nom Voltage(Max)(mA): 0.02; VCC(Max)(V): 6; Schmitt Trigger: No; Rating: Catalog; tpd @ Nom Voltage(Max)(ns): 10,8.5; DatasheetVersion: SCAS536D; PartNumber: SN74AC08DR; PackageReference: D0014A; ComponentLink1Description: Manufacturer URL; Generic Part Number: SN74AC08; ComponentLink2Description: Datasheet; ComponentLink2URL: http://www.ti.com/lit/ds/symlink/sn74ac08.pdf; ComponentLink1URL: http://www.ti.com/; Operating Temperature Range(C): -40 to 85; Output Type: CMOS; PartId: 1
U7 = CMP-0778-00016-3: Quadruple 2-Input Exclusive-OR Gates, D0014A, LARGE T&R; Manufacturer: Texas Instruments; Technology Family: AC; VCC(Min)(V): 2; Rating: Catalog; Output Type: CMOS; ICC @ Nom Voltage(Max)(mA): 0.02; F @ Nom Voltage(Max)(Mhz): 100; Output Drive (IOL/IOH)(Max)(mA): 24/-24; Voltage(Nom)(V): 3.3,5; Schmitt Trigger: No; VCC(Max)(V): 5.5; Bits(#): 4; tpd @ Nom Voltage(Max)(ns): 12.5,9; Generic Part Number: SN74AC86; DatasheetVersion: SCAS533C; PackageReference: D0014A; Operating Temperature Range(C): -40 to 85; Input Type: CMOS; PartId: 1
U16 = CMP-2000-04989-1: Linear Current Sensor, 4.5 to 5.5 V, 10 mA Output Current, -40 to 85 degC, 8-Pin SOIC (LC), RoHS, Tape and Reel; Manufacturer: Allegro Microsystems; SVHC: NoSVHC(19-Dec-2012); Supply Voltage Min: 4.5V; Accuracy: 1.5%; No. of Pins: 8; Supply Voltage Max: 5.5V; Bandwidth: 50kHz; Quiescent Current: 8mA; Supply Voltage Range: 4.5Vto5.5V; Polarisation: Unipolar; Package Description: 8-Pin Small Outline Integrated Circuit, Body 4.9 x 3.9 mm, Pitch 1.27 mm; Operating Temperature Min: -40degC; Datasheet URL: http://www.allegromicro.com/~/media/Files/Datasheets/ACS712-Datasheet.ashx?la=en; Operating Temperature Range: -40degCto+85degC; MSL: MSL2-1year; Sensor Case Style: SOIC; Termination Type: SMD; Manufacturer URL: http://www.allegromicro.com/; Sensor / Transducer Type: Current; Package Reference: LC-8; Operating Temperature Max: 85degC; Datasheet Version: Rev. 15, 11/2012
U17 = INA169

## Sheet ADC.SchDoc
size A4
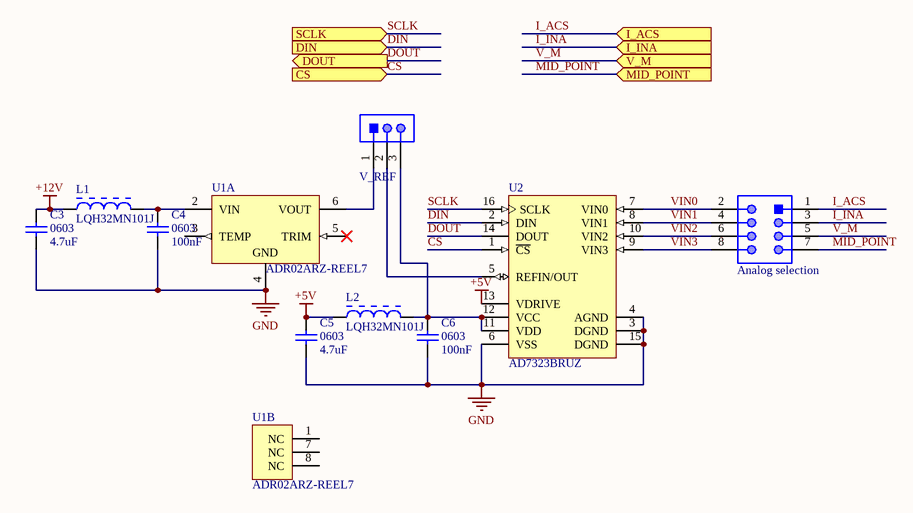
[diagram p3: ADC.SchDoc]

### Parts
Analog_selection  61300821121  [61300821121]  (value not drawn)
C3  value 4.7uF  Case-EIA: 0603  [CAPC0603(1608)55_M]  (hidden comment: CAP 4.7uF 10V 0603(1608))
C4  value 100nF  Case-EIA: 0603  [CAPC0603(1608)100_M]  (hidden comment: CAP 100nF 10V 0603(1608))
C5  value 4.7uF  Case-EIA: 0603  [CAPC0603(1608)55_M]  (hidden comment: CAP 4.7uF 10V 0603(1608))
C6  value 100nF  Case-EIA: 0603  [CAPC0603(1608)100_M]  (hidden comment: CAP 100nF 10V 0603(1608))
L1  Comment_1: LQH32MN101J  [BOUR-SRN3015-2_V]  (hidden comment: CM311411-101KL)
L2  Comment_1: LQH32MN101J  [BOUR-SRN3015-2_V]  (hidden comment: CM311411-101KL)
U1  ADR02ARZ-REEL7  [ADI-R-8_L]  (parts A,B of 2)
U2  AD7323BRUZ  [RU-16_N]
V_REF  61300311121  [61300311121]  (value not drawn)

### Ports
CS (in), DIN (in), DOUT (out), I_ACS (in), I_INA (in), MID_POINT (in), SCLK (in), V_M (in)

### Nets
+5V: C5.2 L2.1 U2.13(VDRIVE)
+12V: C3.2 L1.1
GND: C3.1 C4.1 C5.1 C6.1 U1.4(GND) U2.3(DGND) U2.4(AGND) U2.6(VSS) U2.15(DGND)
CS: U2.1(~{CS}) ; port CS
DIN: U2.2(DIN) ; port DIN
DOUT: U2.14(DOUT) ; port DOUT
I_ACS: Analog_selection.1 ; port I_ACS
I_INA: Analog_selection.3 ; port I_INA
MID_POINT: Analog_selection.7 ; port MID_POINT
SCLK: U2.16(SCLK) ; port SCLK
V_M: Analog_selection.5 ; port V_M
VIN0: Analog_selection.2 U2.7(VIN0)
VIN1: Analog_selection.4 U2.8(VIN1)
VIN2: Analog_selection.6 U2.10(VIN2)
VIN3: Analog_selection.8 U2.9(VIN3)
NetC4_2: C4.2 L1.2 U1.2(VIN)
NetC6_2: C6.2 L2.2 U2.11(VDD) U2.12(VCC) V_REF.3
NetU1_6: U1.6(VOUT) V_REF.1
NetU2_5: U2.5(REFIN/OUT) V_REF.2

Not connected (* = marked no-connect by the designer): U1 1(NC) 3(TEMP) 5(TRIM)* 7(NC) 8(NC)

### Library data of the parts
Analog_selection = CMP-1502-01078-1: as +5V on sheet power; Datasheet URL: https://katalog.we-online.de/em/datasheet/6130xx21121.pdf; Package Reference: 61300821121; Orientation: Vertical; Part Number: 61300821121; Publisher: WurthElektronik; Mounting Technology: THT; Manufacturer URL: http://www.we-online.de; Packaging: Bag; Row Number: Dual; Operating Temperature: -40to105degC
C3 C5 = CMP-1035-02786-1: CAP 4.7uF 10V ±20% 0603 (1608 Metric) Thickness 0.55mm SMD; Tolerance: Â±20%; Case-Metric: 1608; Technology: SMT; Max Thickness: 0.55 mm; Rated Voltage: 10 V
C4 C6 = CMP-1035-02581-1: CAP 100nF 10V ±20% 0603 (1608 Metric) Thickness 1mm SMD; Tolerance: Â±20%; Case-Metric: 1608; Max Thickness: 1 mm; Rated Voltage: 10 V; Technology: SMT
L1 L2 = CMP-0007-00009-1: Semi-shielded Power Inductor, 100 uH, +/- 20%, 0.29 A, -40 to 125 degC, 3 x 3 x 1.5 mm SMD, RoHS and Halogen Free, Tape and Reel; Manufacturer: Bourns; PartNumber: SRN3015-101M; Isat: 0.27 A; Rated current: 0.29 A; DCR Max: 2.92 Ohm; Inductance tolerance: +/- 20%; SRF Min: 11 MHz; Resistance to Solder Heat: +260 degC for 10 sec.; Inductance: 100 uH; ComponentLink3Description: Package Specification; Mounting Technology: Surface Mount; RoHS: TRUE; ComponentLink3URL: http://www.bourns.com/data/global/pdfs/SRN3015.pdf; PackageDescription: 2-Pin SMD, Body 3 x 3 mm, Height 1.5 mm; PackageReference: SRN3015; ComponentLink1Description: Manufacturer URL; ComponentLink2URL: http://www.bourns.com/data/global/pdfs/SRN3015.pdf; Operating Temperature: -40 to 125 degC; DatasheetVersion: Aug-11; ComponentLink1URL: http://www.bourns.com/; Packing: Tape and Reel; ComponentLink2Description: Datasheet
U1 = CMP-0784-00325-1: Ultracompact, Precision Voltage Reference, 5 V Output, 7 to 36 V Supply, Industrial, 8-pin SOIC (R-8), Reel; Manufacturer: Analog Devices; Ref Out TC (ppm/C): 3; Automotive Qualified: Yes; Max V Supply (V): 36; Vout: 5V; Min V Supply (V): 7; PackageVersion: 060506-A, 06/2006; ComponentLink1Description: Manufacturer URL; ComponentLink1URL: http://www.analog.com/en/index.html; PartNumber: ADR02ARZ-REEL7; Operating Temp Range: -40 to 125 degC; ComponentLink4Description: URL Link1; ComponentLink2Description: Datasheet; ComponentLink2URL: http://www.analog.com/static/imported-files/data_sheets/ADR01_02_03_06.pdf; ComponentLink3Description: Package Specification; DatasheetVersion: Rev. R; PackageDescription: 8-Pin Standard Small Outline Package, Body 4.9 x 3.9 mm, Pitch 1.27 mm; Code_JEDEC: MS-012-AA; ComponentLink3URL: http://www.analog.com/static/imported-files/packages/PKG_PDF/SOIC_Narrow%20(R)/R_8.pdf; PackageReference: R-8; Mounting Technology: Surface Mount; Packing: Reel; ComponentLink4URL: Product URL:http://www.analog.com/en/special-linear-functions/voltage-references/adr02/products/product.html; PartId: 1
U2 = CMP-0313-01966-2: Quad 13-Bit True Bipolar Input Plus Sign Analog-to-Digital Converter with Serial, SPI Interface, Software-Selectable, 500KSPS, -40 to +85 degC, RU-16, Pb-Free, Tube; Manufacturer: Analog Devices; Generic Part Number: AD7323; Interface: Ser, SPI; Channels: 4; Resolution (Bits): 13; Throughput Rate (SPS): 500K; PackageReference: RU-16; ComponentLink4URL: http://www.analog.com/en/analog-to-digital-converters/ad-converters/ad7323/products/product.html; PartNumber: AD7323BRUZ; ComponentLink3URL: http://www.analog.com/static/imported-files/packages/36244347913743854010197452789RU16.pdf; Packing: Tube; Mounting Technology: Surface Mount; DatasheetVersion: Rev.A; RoHS: Y; PackageVersion: Nov-2002; ComponentLink2Description: Datasheet; ComponentLink1URL: http://www.analog.com/en/index.html; ComponentLink1Description: Manufacturer URL; Code_JEDEC: MO-153-AB; ComponentLink2URL: http://www.analog.com/static/imported-files/data_sheets/AD7323.pdf; ComponentLink4Description: Product URL; PackageDescription: 16-Lead Thin Shrink Small Outline Package [TSSOP]; ComponentLink3Description: Package Specification
V_REF = CMP-1502-01062-1: as 12V_source on sheet power; Package Reference: 61300311121; Manufacturer URL: http://www.we-online.de; Datasheet URL: https://katalog.we-online.de/em/datasheet/6130xx11121.pdf; Operating Temperature: -40to105degC; Part Number: 61300311121; Orientation: Vertical; Packaging: Bag; Row Number: Single; Mounting Technology: THT; Publisher: WurthElektronik

## Sheet in_buf.SchDoc
size A4
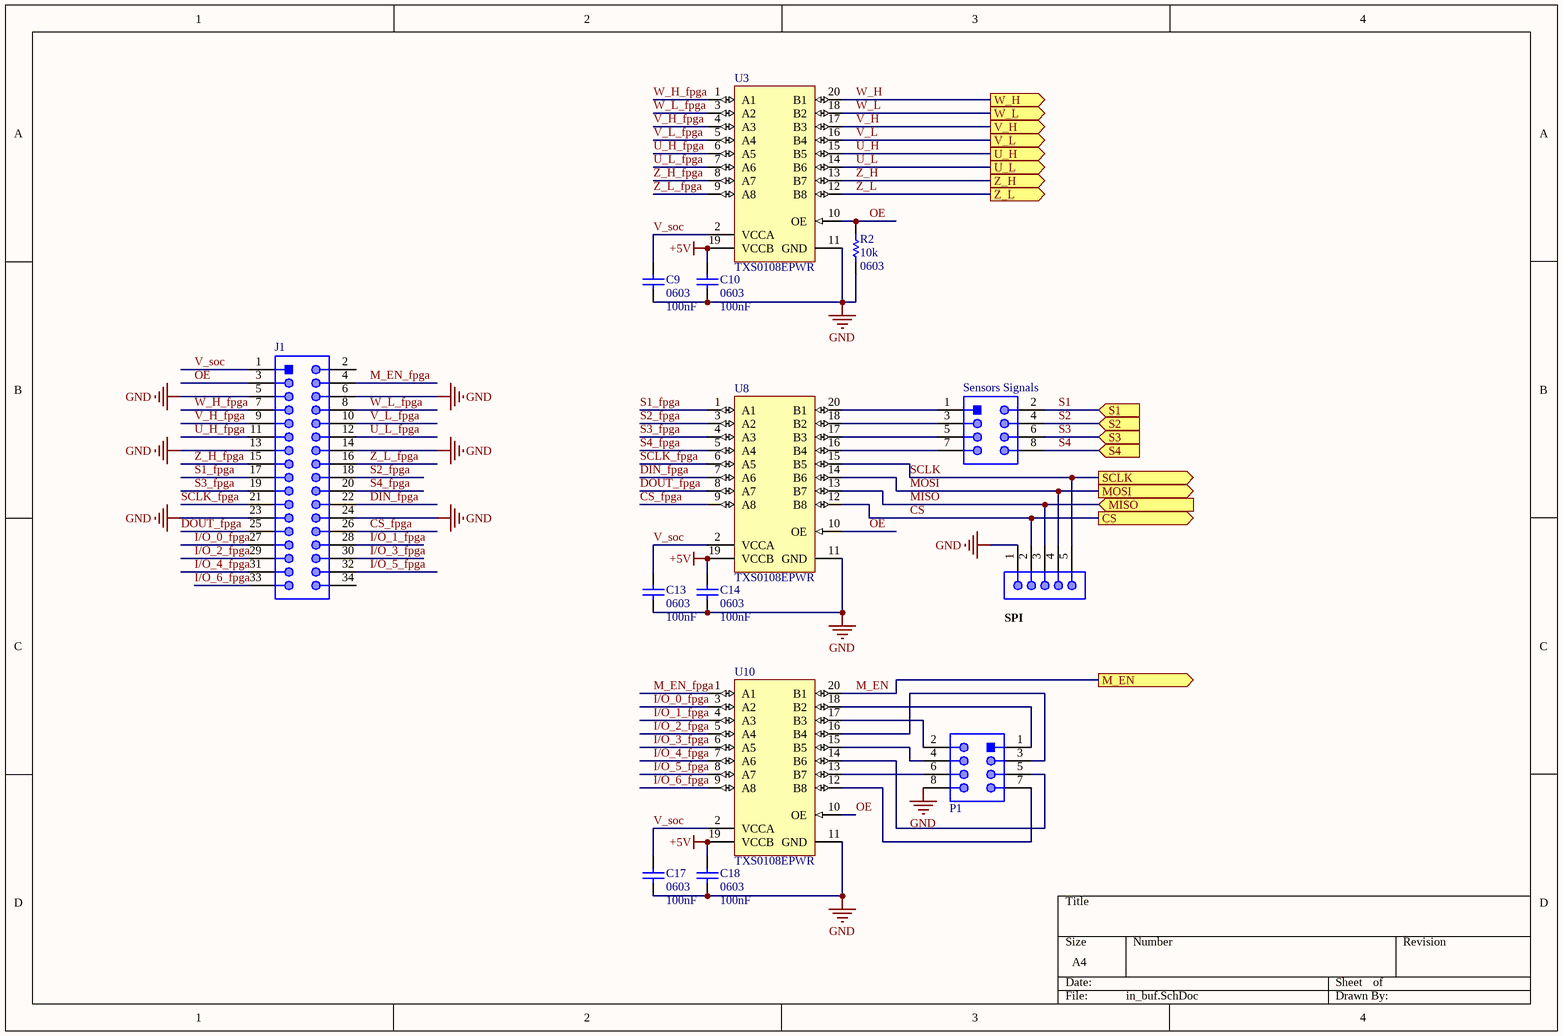
[diagram p4: in_buf.SchDoc]

### Parts
C9  Case Code (Imperial): 0603  Capacitance: 100nF  [CAPC1608X90X35ML10T15]  (hidden comment: GRM188R71H104KA93D)
C10  Case Code (Imperial): 0603  Capacitance: 100nF  [CAPC1608X90X35ML10T15]  (hidden comment: GRM188R71H104KA93D)
C13  Case Code (Imperial): 0603  Capacitance: 100nF  [CAPC1608X90X35ML10T15]  (hidden comment: GRM188R71H104KA93D)
C14  Case Code (Imperial): 0603  Capacitance: 100nF  [CAPC1608X90X35ML10T15]  (hidden comment: GRM188R71H104KA93D)
C17  Case Code (Imperial): 0603  Capacitance: 100nF  [CAPC1608X90X35ML10T15]  (hidden comment: GRM188R71H104KA93D)
C18  Case Code (Imperial): 0603  Capacitance: 100nF  [CAPC1608X90X35ML10T15]  (hidden comment: GRM188R71H104KA93D)
J1  61303421121  [61303421121]  (value not drawn)
P1  61300821121  [61300821121]  (value not drawn)
R2  Resistance (Ohms): 10k  Package Reference: 0603  [RESC1608X55X30ML15T20]  (hidden comment: RMCF0603FT10K0)
Sensors_Signals  61300821121  [61300821121]  (value not drawn)
SPI  PH2541-5-SPGRH-6-3  [PH2541-5-SPGRH-6-3_V]  (value not drawn)
U3  TXS0108EPWR  [PW0020A_M]
U8  TXS0108EPWR  [PW0020A_M]
U10  TXS0108EPWR  [PW0020A_M]

### Ports
CS (out), M_EN (out), MISO (in), MOSI (out), S1 (in), S2 (in), S3 (in), S4 (in), SCLK (out), U_H (out), U_L (out), V_H (out), V_L (out), W_H (out), W_L (out), Z_H (out), Z_L (out)

### Nets
+5V: C10.2 C14.2 C18.2 U3.19(VCCB) U8.19(VCCB) U10.19(VCCB)
GND: C9.1 C10.1 C13.1 C14.1 C17.1 C18.1 J1.5 J1.6 J1.13 J1.14 J1.23 J1.24 P1.8 R2.1 SPI.1 U3.11(GND) U8.11(GND) U10.11(GND)
CS: SPI.2 U8.12(B8) ; port CS
CS_fpga: J1.26 U8.9(A8)
DIN_fpga: J1.22 U8.7(A6)
DOUT_fpga: J1.25 U8.8(A7)
I/O_0_fpga: J1.27 U10.3(A2)
I/O_1_fpga: J1.28 U10.4(A3)
I/O_2_fpga: J1.29 U10.5(A4)
I/O_3_fpga: J1.30 U10.6(A5)
I/O_4_fpga: J1.31 U10.7(A6)
I/O_5_fpga: J1.32 U10.8(A7)
I/O_6_fpga: J1.33 U10.9(A8)
M_EN: U3.18(B2) U10.20(B1) ; port W_L, port M_EN  [also labelled W_L]
M_EN_fpga: J1.4 U10.1(A1)
MISO: SPI.3 U8.13(B7) ; port MISO  [project net DOUT]
MOSI: SPI.4 U8.14(B6) ; port MOSI  [project net DIN]
OE: J1.3 R2.2 U3.10(OE) U8.10(OE) U10.10(OE)
S1: Sensors_Signals.2 ; port S1
S1_fpga: J1.17 U8.1(A1)
S2: Sensors_Signals.4 ; port S2
S2_fpga: J1.18 U8.3(A2)
S3: Sensors_Signals.6 ; port S3
S3_fpga: J1.19 U8.4(A3)
S4: Sensors_Signals.8 ; port S4
S4_fpga: J1.20 U8.5(A4)
SCLK: SPI.5 U8.15(B5) ; port SCLK
SCLK_fpga: J1.21 U8.6(A5)
U_H: U3.15(B5) ; port U_H
U_H_fpga: J1.11 U3.6(A5)
U_L: U3.14(B6) ; port U_L
U_L_fpga: J1.12 U3.7(A6)
V_H: U3.17(B3) ; port V_H
V_H_fpga: J1.9 U3.4(A3)
V_L: U3.16(B4) ; port V_L
V_L_fpga: J1.10 U3.5(A4)
V_soc: C9.2 C13.2 C17.2 J1.1 U3.2(VCCA) U8.2(VCCA) U10.2(VCCA)
W_H: U3.20(B1) ; port W_H
W_H_fpga: J1.7 U3.1(A1)
W_L_fpga: J1.8 U3.3(A2)
Z_H: U3.13(B7) ; port Z_H
Z_H_fpga: J1.15 U3.8(A7)
Z_L: U3.12(B8) ; port Z_L
Z_L_fpga: J1.16 U3.9(A8)
NetP1_1: P1.1 U10.18(B2)
NetP1_2: P1.2 U10.17(B3)
NetP1_3: P1.3 U10.16(B4)
NetP1_4: P1.4 U10.15(B5)
NetP1_5: P1.5 U10.14(B6)
NetP1_6: P1.6 U10.13(B7)
NetP1_7: P1.7 U10.12(B8)
NetSensors_Signals_1: Sensors_Signals.1 U8.20(B1)
NetSensors_Signals_3: Sensors_Signals.3 U8.18(B2)
NetSensors_Signals_5: Sensors_Signals.5 U8.17(B3)
NetSensors_Signals_7: Sensors_Signals.7 U8.16(B4)

Not connected (* = marked no-connect by the designer): J1 2 34

### Library data of the parts
C9 C10 C13 C14 C17 C18 = CMP-2100-03643-1: as C24 on sheet driver; Case Code (Metric): 1608; Lead Free: LeadFree; Depth: 0.8mm; Number of Pins: 2; Radiation Hardening: No; Case/Package: 0603; Manufacturer URL: http://www.murata.com/; Packaging: TapeandReel; Length: 1.6mm; Contact Plating: Tin; Datasheet URL: http://psearch.en.murata.com/capacitor/product/GRM188R71H104KA93%23.pdf; Tolerance: 10%; Min Operating Temperature: -55degC; RoHSCompliant: true; Voltage: 50V; Termination: SMD/SMT; Mount: SurfaceMount; Material: Ceramic; Package Quantity: 1; Height: 0.8mm; Thickness: 0.035inch; REACH SVHC: NoSVHC; Max Operating Temperature: 125degC; Width: 0.8mm; Package Reference: 0603; Voltage Rating (DC): 50V; Datasheet Version: 42675.0; Package Description: 2-Pin Surface Mount Device, Body 1.6 x 0.8 mm
J1 = CMP-1502-01127-1: THT Vertical Pin Header WR-PHD, Pitch 2.54 mm, Dual Row, 34 pins; Manufacturer: Wurth Elektronik; Pitch: 2.54mm; Rated Current: 3A; Withstanding Voltage: 500VAC; Working Voltage: 250VAC; Gender: Male; Pin Number: 34; Contact Resistance: 20mOhm; Operating Temperature: -40to105degC; Part Number: 61303421121; Mounting Technology: THT; Packaging: Bag; Package Reference: 61303421121; Row Number: Dual; Manufacturer URL: http://www.we-online.de; Datasheet URL: https://katalog.we-online.de/em/datasheet/6130xx21121.pdf; Orientation: Vertical; Publisher: WurthElektronik
P1 Sensors_Signals = CMP-1502-01078-1: as +5V on sheet power; Datasheet URL: https://katalog.we-online.de/em/datasheet/6130xx21121.pdf; Package Reference: 61300821121; Orientation: Vertical; Part Number: 61300821121; Publisher: WurthElektronik; Mounting Technology: THT; Manufacturer URL: http://www.we-online.de; Packaging: Bag; Row Number: Dual; Operating Temperature: -40to105degC
R2 = CMP-2000-06990-1: as R32 on sheet driver; Package / Case: 0603(1608Metric); Datasheet Version: 01/2017; Features: AutomotiveAEC-Q200; Packaging: CutTape(CT); Series: RMCF; Tolerance: ±1%; Manufacturer URL: https://www.seielect.com/; Datasheet URL: https://www.seielect.com/Catalog/SEI-RMCF_RMCP.pdf; Supplier Device Package: 0603; Number of Terminations: 2; Family: ChipResistor-SurfaceMount; Mounting Technology: SurfaceMount; Package Description: 2-Pin Surface Mount Device, Body 1.55 x 0.8 mm; Operating Temperature: -55°C~155°C; Composition: ThickFilm; Category: Resistors
SPI = CMP-0261-00002-1: Male Header, Pitch 2.54mm, 5x1 Position, Mated Height 6mm, Tail Length 3mm; PartNumber: PH2541-5-SPGRH-6-3; ComponentLink1URL: http://www.suzhoupinchao.com/; PackageReference: PH2541-5-SPGRH-6-3; Mounting Technology: Through Hole; ComponentLink1Description: Manufacturer URL; PackageDescription: 5-Pin Male Header IDC, 2.54 x 12.7 mm Body, 2.54 mm Pitch
U3 U8 U10 = CMP-2000-04956-1: Bidirectional Voltage-Level Translator for Open-Drain and Push-Pull Application, 8 bit, 1.2 to 3.6 V, -40 to 85 degC, 20-Pin TSSOP, Green (RoHS & no Sb/Br), Tape and Reel; Manufacturer: Texas Instruments; Logic Type: VoltageLevelTranslator; Output Current: 620µA; Propagation Delay: 4.8ns; Supply Voltage Min: 1.2V; No. of Inputs: 8; Supply Voltage Max: 5.5V; SVHC: NoSVHC(16-Jun-2014); No. of Pins: 20; Datasheet URL: https://datasheet.ciiva.com/14287/txs0108e-14287280.pdf; Operating Temperature Min: -40degC; Logic Case Style: TSSOP; Packaging: CutTape; Datasheet Version: Rev. B, 09/2008; MSL: MSL1-Unlimited; Manufacturer URL: http://www.ti.com/; Operating Temperature Max: 85degC